# EAGLE design buckpuckV5_2014-12-10 (EAGLE 6.4)
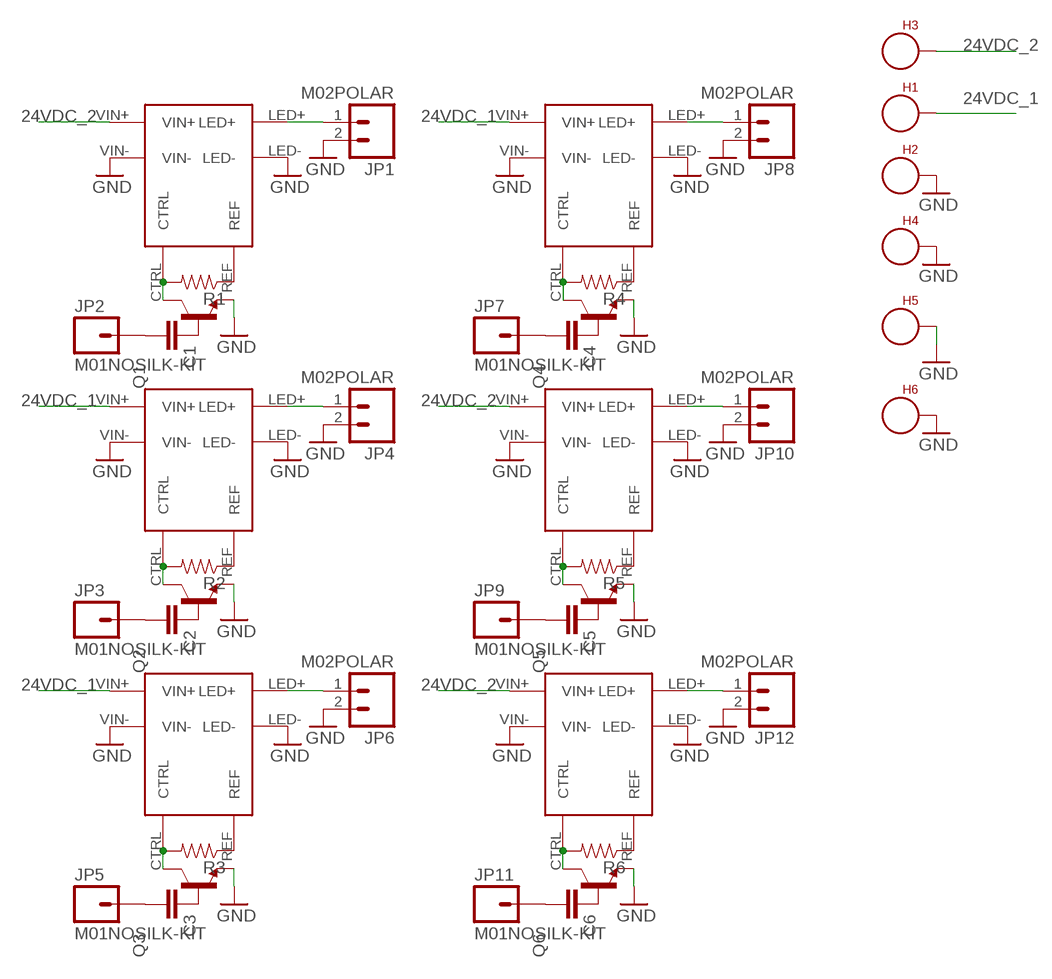
[diagram p0: schematic, sheet 1]

## Parts
C1  CAPEZ  [CAP-PTH-SMALLEZ]
C2  CAPEZ  [CAP-PTH-SMALLEZ]
C3  CAPEZ  [CAP-PTH-SMALLEZ]
C4  CAPEZ  [CAP-PTH-SMALLEZ]
C5  CAPEZ  [CAP-PTH-SMALLEZ]
C6  CAPEZ  [CAP-PTH-SMALLEZ]
H1  SEW_HOLE  [SIMPLE_HOLE]
H2  SEW_HOLE  [SIMPLE_HOLE]
H3  SEW_HOLE  [SIMPLE_HOLE]
H4  SEW_HOLE  [SIMPLE_HOLE]
H5  SEW_HOLE  [SIMPLE_HOLE]
H6  SEW_HOLE  [SIMPLE_HOLE]
JP1  M02POLAR  [MOLEX-1X2]
JP2  M01NOSILK-KIT  [1X01NS-KIT]
JP3  M01NOSILK-KIT  [1X01NS-KIT]
JP4  M02POLAR  [MOLEX-1X2]
JP5  M01NOSILK-KIT  [1X01NS-KIT]
JP6  M02POLAR  [MOLEX-1X2]
JP7  M01NOSILK-KIT  [1X01NS-KIT]
JP8  M02POLAR  [MOLEX-1X2]
JP9  M01NOSILK-KIT  [1X01NS-KIT]
JP10  M02POLAR  [MOLEX-1X2]
JP11  M01NOSILK-KIT  [1X01NS-KIT]
JP12  M02POLAR  [MOLEX-1X2]
Q1  TRANSISTOR_BJT_NPN-TO-92-EBC  [TO-92]
Q2  TRANSISTOR_BJT_NPN-TO-92-EBC  [TO-92]
Q3  TRANSISTOR_BJT_NPN-TO-92-EBC  [TO-92]
Q4  TRANSISTOR_BJT_NPN-TO-92-EBC  [TO-92]
Q5  TRANSISTOR_BJT_NPN-TO-92-EBC  [TO-92]
Q6  TRANSISTOR_BJT_NPN-TO-92-EBC  [TO-92]
R1  RESISTOREZ  [AXIAL-0.3EZ]
R2  RESISTOREZ  [AXIAL-0.3EZ]
R3  RESISTOREZ  [AXIAL-0.3EZ]
R4  RESISTOREZ  [AXIAL-0.3EZ]
R5  RESISTOREZ  [AXIAL-0.3EZ]
R6  RESISTOREZ  [AXIAL-0.3EZ]
U$1  BUCKPUCK  [BUCKPUCK]
U$2  BUCKPUCK  [BUCKPUCK]
U$3  BUCKPUCK  [BUCKPUCK]
U$4  BUCKPUCK  [BUCKPUCK]
U$5  BUCKPUCK  [BUCKPUCK]
U$6  BUCKPUCK  [BUCKPUCK]

## Nets
24VDC_1 [led]: H1.P$1 U$2.VIN+ U$3.VIN+ U$4.VIN+
24VDC_2 [led]: H3.P$1 U$1.VIN+ U$5.VIN+ U$6.VIN+
GND: H2.P$1 H4.P$1 H5.P$1 H6.P$1 JP1.2 JP4.2 JP6.2 JP8.2 JP10.2 JP12.2 Q1.1(E) Q2.1(E) Q3.1(E) Q4.1(E) Q5.1(E) Q6.1(E) U$1.LED- U$1.VIN- U$2.LED- U$2.VIN- U$3.LED- U$3.VIN- U$4.LED- U$4.VIN- U$5.LED- U$5.VIN- U$6.LED- U$6.VIN-
N$1: R1.P$1 U$1.REF
N$2: Q1.3(C) R1.P$2 U$1.CTRL
N$3: C1.1 Q1.2(B)
N$4: R4.P$1 U$4.REF
N$5 [led]: JP1.1 U$1.LED+
N$6: C1.2 JP2.1
N$7: C2.1 Q2.2(B)
N$8: Q2.3(C) R2.P$2 U$2.CTRL
N$9: C4.1 Q4.2(B)
N$10: C3.1 Q3.2(B)
N$11 [led]: JP4.1 U$2.LED+
N$12: C2.2 JP3.1
N$13: C6.1 Q6.2(B)
N$14: Q3.3(C) R3.P$2 U$3.CTRL
N$15: Q4.3(C) R4.P$2 U$4.CTRL
N$17 [led]: JP6.1 U$3.LED+
N$18: C3.2 JP5.1
N$19: R2.P$1 U$2.REF
N$20: C5.1 Q5.2(B)
N$21: R5.P$1 U$5.REF
N$22: R3.P$1 U$3.REF
N$23 [led]: JP8.1 U$4.LED+
N$24: C4.2 JP7.1
N$25: R6.P$1 U$6.REF
N$26: Q5.3(C) R5.P$2 U$5.CTRL
N$29 [led]: JP10.1 U$5.LED+
N$30: C5.2 JP9.1
N$32: Q6.3(C) R6.P$2 U$6.CTRL
N$35 [led]: JP12.1 U$6.LED+
N$36: C6.2 JP11.1

## Library data of the parts
C1-C6 = SparkFun-Capacitors:CAP: Capacitor Standard 0603 ceramic capacitor, and 0.1" leaded capacitor.
H1-H6 = LilyPad-Wearables:SEW_HOLE: Simple sew-hole .1" diameter hole with 20mil annular ring
JP1 JP4 JP6 JP8 JP10 JP12 = SparkFun-Connectors:M02: Standard 2-pin 0.1" header. Use with - straight break away headers ( PRT-00116) - right angle break away headers (PRT-00553) - swiss pins (PRT-00743) - machine pins (PRT-00117) - female headers (PRT-00115) Molex polarized connector foot print use with: PRT-08233 with associated crimp pins and housings. 2.54_SCREWTERM for use with PRT-10571. 3.5mm Screw Terminal footprints for PRT-08084 5mm Screw Terminal footprints for use with PRT-08432
JP2 JP3 JP5 JP7 JP9 JP11 = SparkFun-Connectors:M01: Header 1 Standard 1-pin 0.1" header. Use with straight break away headers (SKU : PRT-00116), right angle break away headers (PRT-00553), swiss pins (PRT-00743), machine pins (PRT-00117), and female headers (PRT-00115).
Q1-Q6 = dp_devices:TRANSISTOR_BJT_NPN: Most commonly used is SOT23-BEC
R1-R6 = SparkFun-Passives:RESISTOR: Resistor Basic schematic elements and footprints for 0603, 1206, and PTH resistors.
U$1-U$6 = BuckPuck:BUCKPUCK

## Net classes
1 gnd: width 0.508 mm
2 led: width 1.27 mm, clearance 0.406 mm

## Board
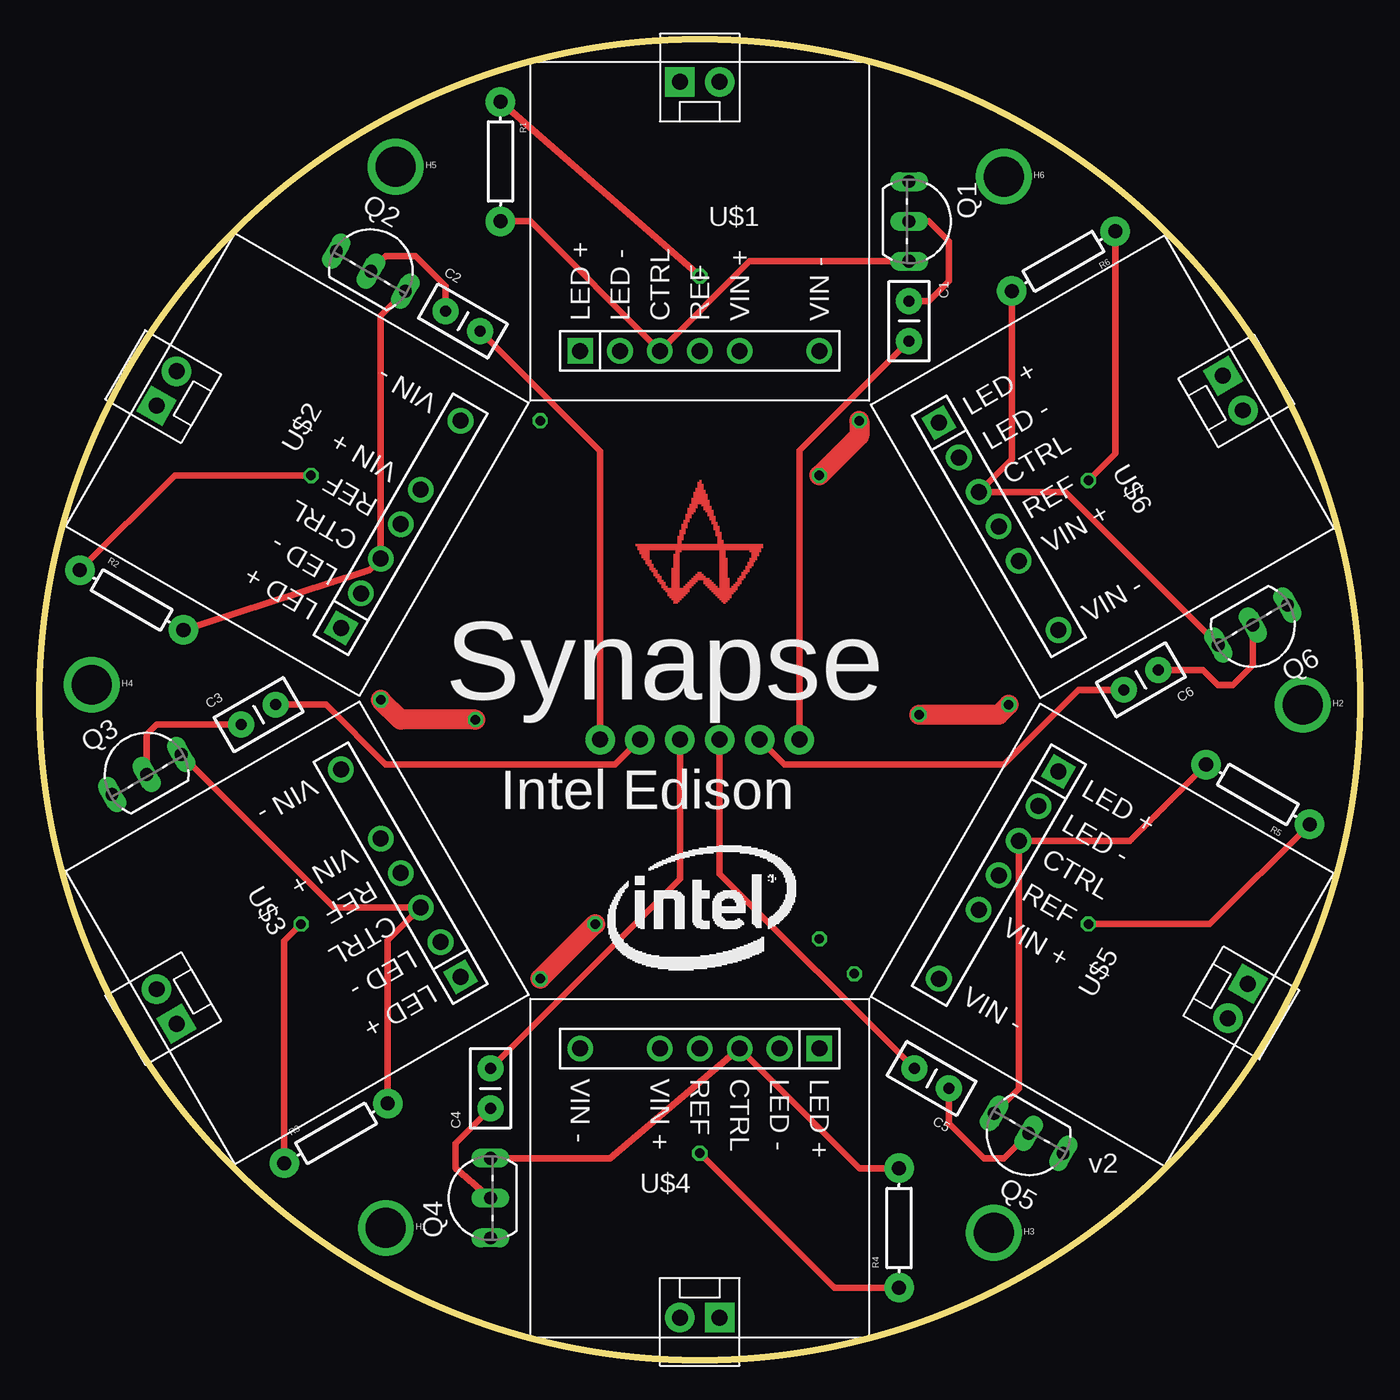
[diagram p1: board, top side]
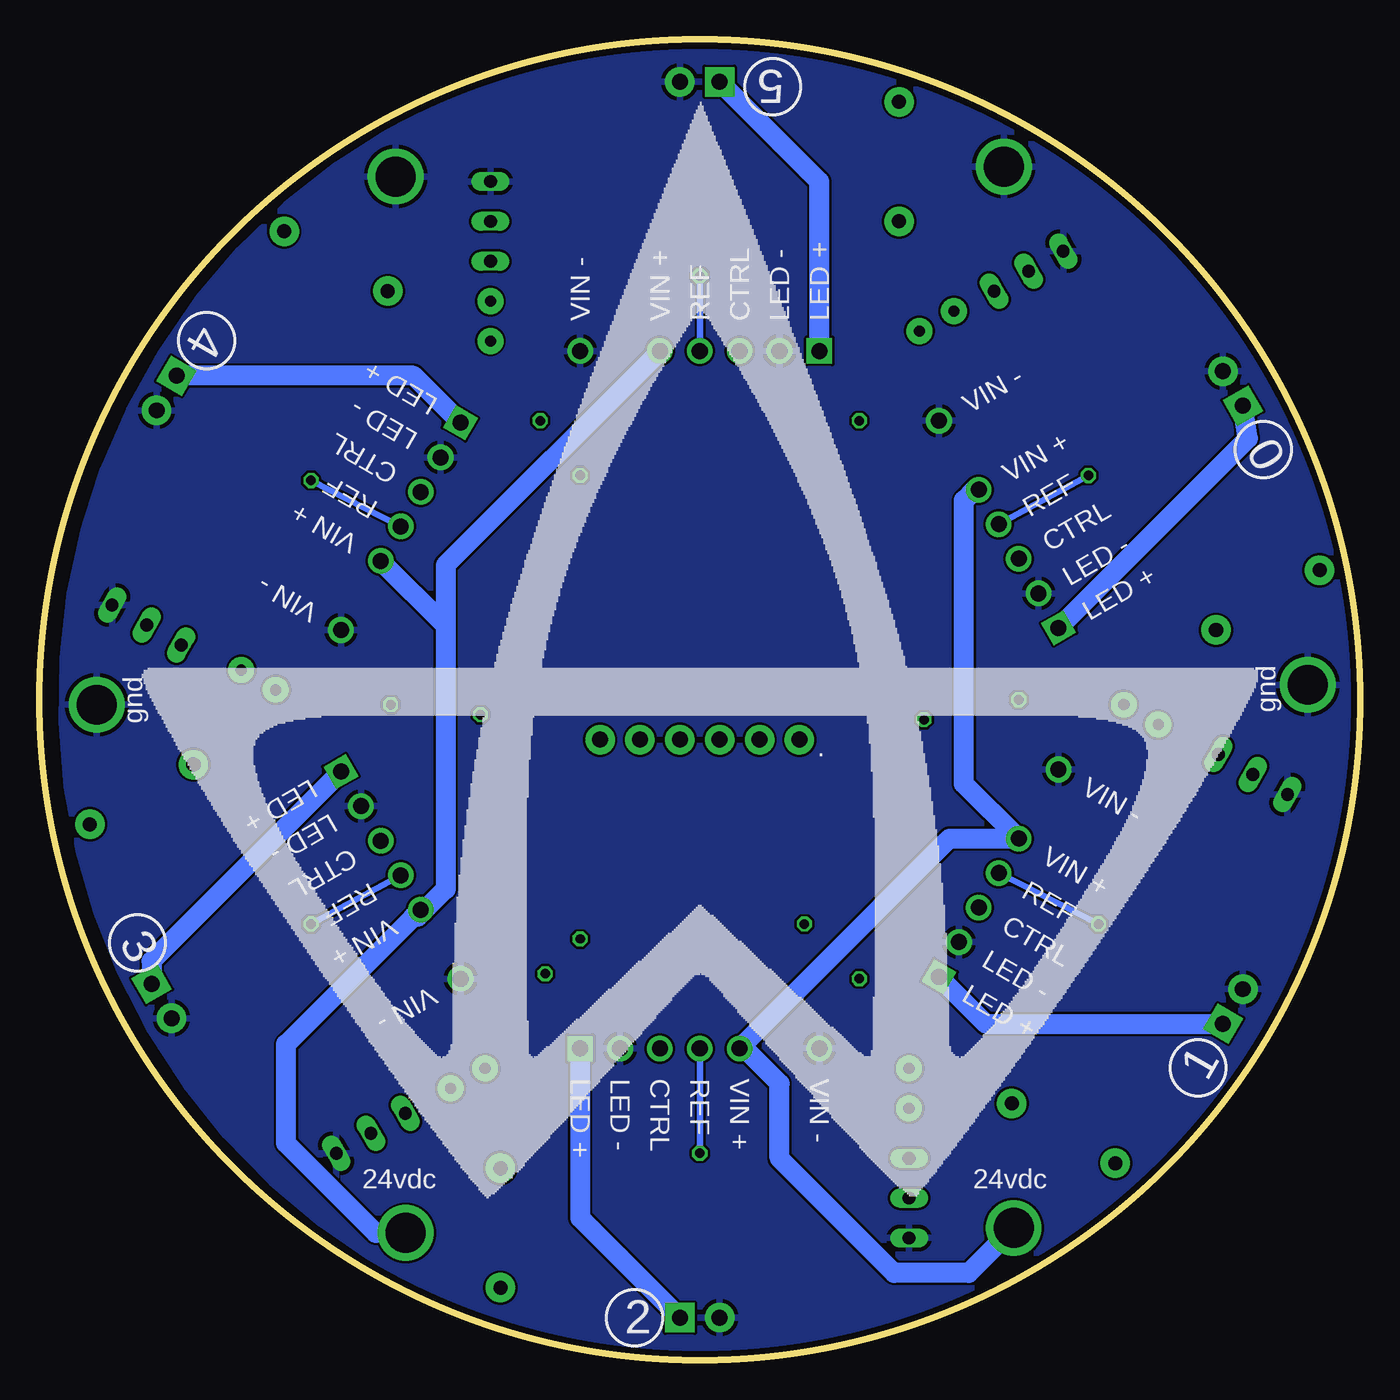
[diagram p2: board, bottom side, seen from below]

Size 84.17 x 84.17 mm. Coordinates in mm from the lower left corner, seen from the top.
Outline: circle at 42.08,42.08 radius 42.08
Copper layers (1*16): Top 0.0356mm / dielectric 1.5011mm / Bottom 0.0356mm
Design rules "LaenPCBOrder": minimum track width 6mil, minimum drill 13mil, track to track 6mil, track to pad 6mil, pad to pad 6mil, via to via 6mil, smd to smd 6mil, copper to edge 15mil, drill to drill 6mil, minimum pad ring 7mil, minimum via ring 7mil, stop-mask expansion 3mil, vias tented up to drill 0mil, thermal gap 10mil

### Footprints (pad centres in the part's own frame; a part is rotated, then mirrored left to right if it is on the bottom)
CAP-PTH-SMALLEZ = drill 0.7 pad 1.651: 1 0,0; 2 2.54,0
SIMPLE_HOLE = drill 2.54 pad 3.048: P$1 0,0
MOLEX-1X2 = drill 1.016 pad 1.88 square: 1 0,0 | drill 1.016 pad 1.88: 2 2.54,0
1X01NS-KIT = drill 1.016 pad 1.88: 1 0,0
TO-92 = drill 0.813 long: 1 -2.54,0; 2 0,0; 3 2.54,0
AXIAL-0.3EZ = drill 0.9 pad 1.88: P$1 -3.81,0; P$2 3.81,0
BUCKPUCK = drill 1.02 pad 1.632: CTRL 10.16,0; LED- 12.7,0; REF 7.62,0; VIN+ 5.08,0; VIN- 0,0 | drill 1.02 pad 1.632 square: LED+ 15.24,0

### Placement (x,y rotation side)
C1  55.42,67.48 270 top
C2  25.89,66.85 330 top
C3  12.87,40.5 30 top
C4  28.75,16.05 90 top
C5  57.96,17.32 150 top
C6  71.29,43.99 210 top
H1  22.08,8.43 0 top
H2  80.5,41.77 0 top
H3  60.82,8.11 0 top
H4  3.35,43.04 0 top
H5  22.72,76.06 0 top
H6  61.45,75.42 0 top
JP1  40.81,81.45 0 top
JP2  48.43,39.54 0 top
JP3  35.73,39.54 0 top
JP4  7.48,60.82 60 top
JP5  38.27,39.54 0 top
JP6  8.75,21.45 120 top
JP7  40.81,39.54 0 top
JP8  43.35,2.71 180 top
JP9  43.35,39.54 0 top
JP10  77.01,23.99 240 top
JP11  45.89,39.54 0 top
JP12  75.42,62.72 300 top
Q1  55.42,72.56 270 top
Q2  21.13,69.39 330 top
Q3  6.84,37.32 30 top
Q4  28.75,10.33 90 top
Q5  63.04,14.46 150 top
Q6  77.33,46.85 210 top
R1  29.38,76.37 270 top
R2  5.89,48.43 330 top
R3  18.91,14.46 30 top
R4  54.78,8.43 90 top
R5  77.64,36.05 150 top
R6  65.26,70.02 210 top
U$1  49.7,64.31 180 top
U$2  26.84,59.86 240 top
U$3  19.22,37.64 300 top
U$4  34.46,19.86 0 top
U$5  57.32,24.3 60 top
U$6  64.94,46.53 120 top
U$7  [NOUKLOGO3IN]  42.08,29.07 0 bottom
U$8  [NOUKLOGO300MIL_COPPER]  42.05,50.24 0 top

### Tracks (layer width: path | path; a pad name or v marks a point on that pad's centre or on a via)
24VDC_1
  Bottom 1.27: H1.P$1 24.94,5.57 29.7,5.57 37,12.87 37,17.63 39.23,19.86 U$4.VIN+ 26.16,33.24 U$3.VIN+ 25.25,36.73 25.25,54.78 24.57,55.46 U$2.VIN+
24VDC_2
  Bottom 1.27: H3.P$1 62.72,8.11 68.44,13.82 68.44,20.13 60.32,28.25 | 60.32,28.25 U$5.VIN+ | U$6.VIN+ 58.27,46.8 | 58.27,46.8 58.27,43.99 58.27,30.02 60.04,28.25 60.32,28.25 | U$1.VIN+ 58.27,50.66 58.27,46.8
GND
  pour Bottom: 42.08,0.17 40.81,0.17 arc-182 42.08,83.99 arc-175 43.35,0.17 arc-7
N$1  (via drill 0.6)
  Top 0.406: R1.P$1 v42.08,69.07
  Bottom 0.406: v42.08,69.07 U$1.REF
N$2
  Top 0.406: Q1.3 45.26,70.02 U$1.CTRL 31.29,72.56 R1.P$2
N$3
  Top 0.406: C1.1 56.69,67.48 57.96,68.75 57.96,71.29 56.69,72.56 Q1.2
N$4  (via drill 0.6)
  Top 0.406: v42.08,13.19 50.66,4.62 R4.P$1
  Bottom 0.406: U$4.REF v42.08,13.19
N$5
  Bottom 1.27: U$1.LED+ 34.46,75.1 JP1.1
N$6
  Top 0.406: JP2.1 48.43,57.96 C1.2
N$7
  Top 0.406: C2.1 25.89,68.44 23.98,70.34 22.08,70.34 Q2.2
N$8
  Top 0.406: Q2.3 21.76,66.55 U$2.CTRL 21.04,50.34 R2.P$2
N$9
  Top 0.406: C4.1 26.52,13.82 26.52,12.24 Q4.2
N$10
  Top 0.406: C3.1 7.48,40.49 6.84,39.86 Q3.2
N$11
  Bottom 1.27: U$2.LED+ 7.16,58.73 JP4.1
N$12
  Top 0.406: JP3.1 35.73,57.93 C2.2
N$13
  Top 0.406: C6.1 74.15,43.99 75.1,43.03 76.05,43.03 77.33,44.31 Q6.2
N$14
  Top 0.406: Q3.3 18.79,28.84 U$3.CTRL 22.2,26.74 R3.P$2
N$15
  Top 0.406: Q4.3 36.37,12.87 U$4.CTRL 52.24,12.24 R4.P$2
N$17
  Bottom 1.27: U$3.LED+ 23.85,21.45 JP6.1
N$18
  Top 0.406: JP5.1 36.69,37.95 22.08,37.95 18.27,41.77 C3.2
N$19  (via drill 0.6)
  Top 0.406: v17.32,56.37 8.62,56.37 R2.P$1
  Bottom 0.406: U$2.REF v17.32,56.37
N$20
  Top 0.406: C5.1 57.96,15.09 60.18,12.87 61.45,12.87 Q5.2
N$21  (via drill 0.6)
  Top 0.406: v66.85,27.79 74.59,27.79 R5.P$1
  Bottom 0.406: U$5.REF v66.85,27.79
N$22  (via drill 0.6)
  Top 0.406: v16.68,27.79 15.61,26.72 R3.P$1
  Bottom 0.406: U$3.REF v16.68,27.79
N$23
  Bottom 1.27: U$4.LED+ 49.7,9.06 JP8.1
N$24
  Top 0.406: JP7.1 40.81,30.65 C4.2
N$25  (via drill 0.6)
  Top 0.406: v66.85,56.05 68.56,57.76 R6.P$1
  Bottom 0.406: U$6.REF v66.85,56.05
N$26
  Top 0.406: Q5.3 62.4,17.29 U$5.CTRL 69.49,33.1 R5.P$2
N$27  (via drill 0.6)
  Top 1.27: v52.24,59.86 52.24,58.91 v49.7,56.37
N$28  (via drill 0.6)
  other vias: 31.92,59.86
N$29
  Bottom 1.27: U$5.LED+ 77.01,25.44 JP10.1
N$30
  Top 0.406: JP9.1 43.35,30.99 C5.2
N$32
  Top 0.406: Q6.3 65.37,55.33 U$6.CTRL 61.96,57.42 R6.P$2
N$33  (via drill 0.6)
  Top 1.27: v31.92,24.3 v35.41,27.79
N$34  (via drill 0.6)
  other vias: 51.93,24.62
N$35
  Bottom 1.27: U$6.LED+ 60.32,62.72 JP12.1
N$36
  Top 0.406: JP11.1 47.48,37.95 61.45,37.95 66.21,42.72 C6.2
N$38  (via drill 0.6)
  other vias: 49.7,26.84
N$39  (via drill 0.6)
  Top 1.27: v56.05,41.13 61.13,41.13 v61.77,41.77
N$41  (via drill 0.6)
  Top 1.27: v27.79,40.81 23.03,40.81 v21.76,42.08

### Text on the board
tPlace: Synapse | Intel Edison | v2
bPlace: 5 | 4 | 0 | gnd | gnd | . | 3 | 1 | 24vdc | 24vdc | 2